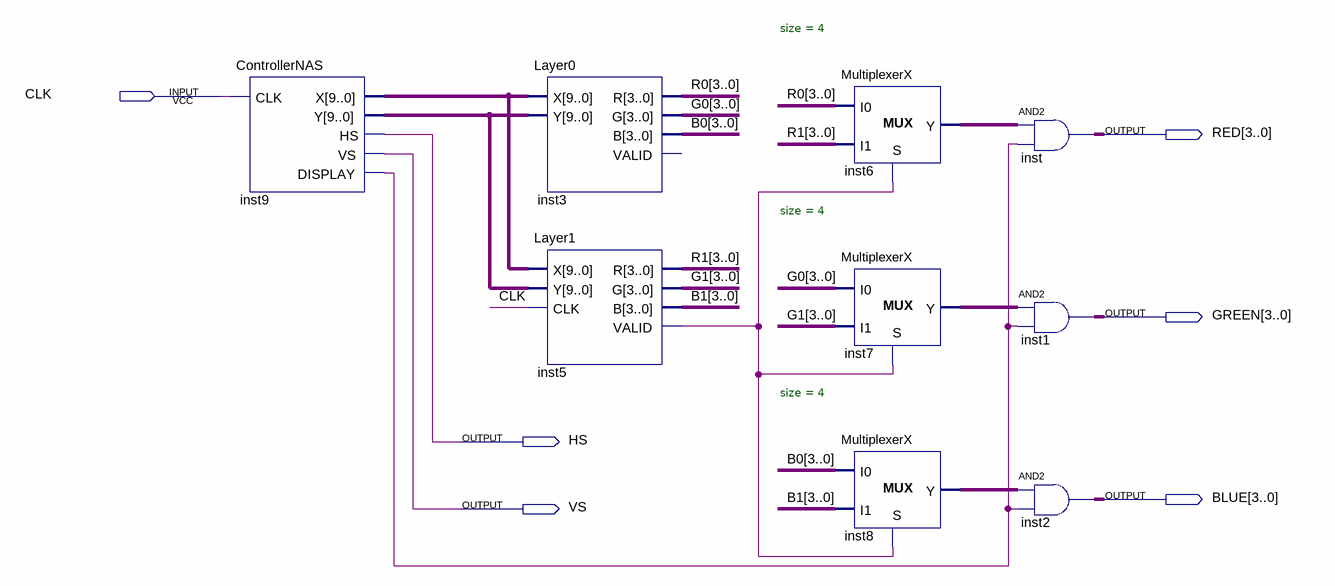
[diagram p0: schematic sheet]
// Quartus schematic Monitor.bdf as structural Verilog: 9 symbols, 6 pins
module Monitor (
  input  CLK,
  output [3:0] RED,
  output [3:0] GREEN,
  output HS,
  output [3:0] BLUE,
  output VS
);

  wire inst5_valid, inst9_display;
  wire [3:0] B0, B1, G0, G1, inst6_y, inst7_y, inst8_y, R0, R1;
  wire [9:0] inst9_x, inst9_y;

  ControllerNAS inst9 (.CLK(CLK), .X(inst9_x), .Y(inst9_y), .HS(HS), .VS(VS), .DISPLAY(inst9_display));
  Layer0 inst3 (.X(inst9_x), .Y(inst9_y), .R(R0), .G(G0), .B(B0));  // open: VALID
  Layer1 inst5 (.X(inst9_x), .Y(inst9_y), .CLK(CLK), .R(R1), .G(G1), .B(B1), .VALID(inst5_valid));
  MultiplexerX #(.size(4)) inst6 (.S(inst5_valid), .I0(R0), .I1(R1), .Y(inst6_y));
  MultiplexerX #(.size(4)) inst7 (.S(inst5_valid), .I0(G0), .I1(G1), .Y(inst7_y));
  MultiplexerX #(.size(4)) inst8 (.S(inst5_valid), .I0(B0), .I1(B1), .Y(inst8_y));
  assign RED = inst6_y & {4{inst9_display}};  // AND2 inst, 4 bits wide
  assign GREEN = inst7_y & {4{inst9_display}};  // AND2 inst1, 4 bits wide
  assign BLUE = inst8_y & {4{inst9_display}};  // AND2 inst2, 4 bits wide
endmodule
